# EAGLE design 8bitPig-BaconHomev2-mainPCB (EAGLE 9.2.2)
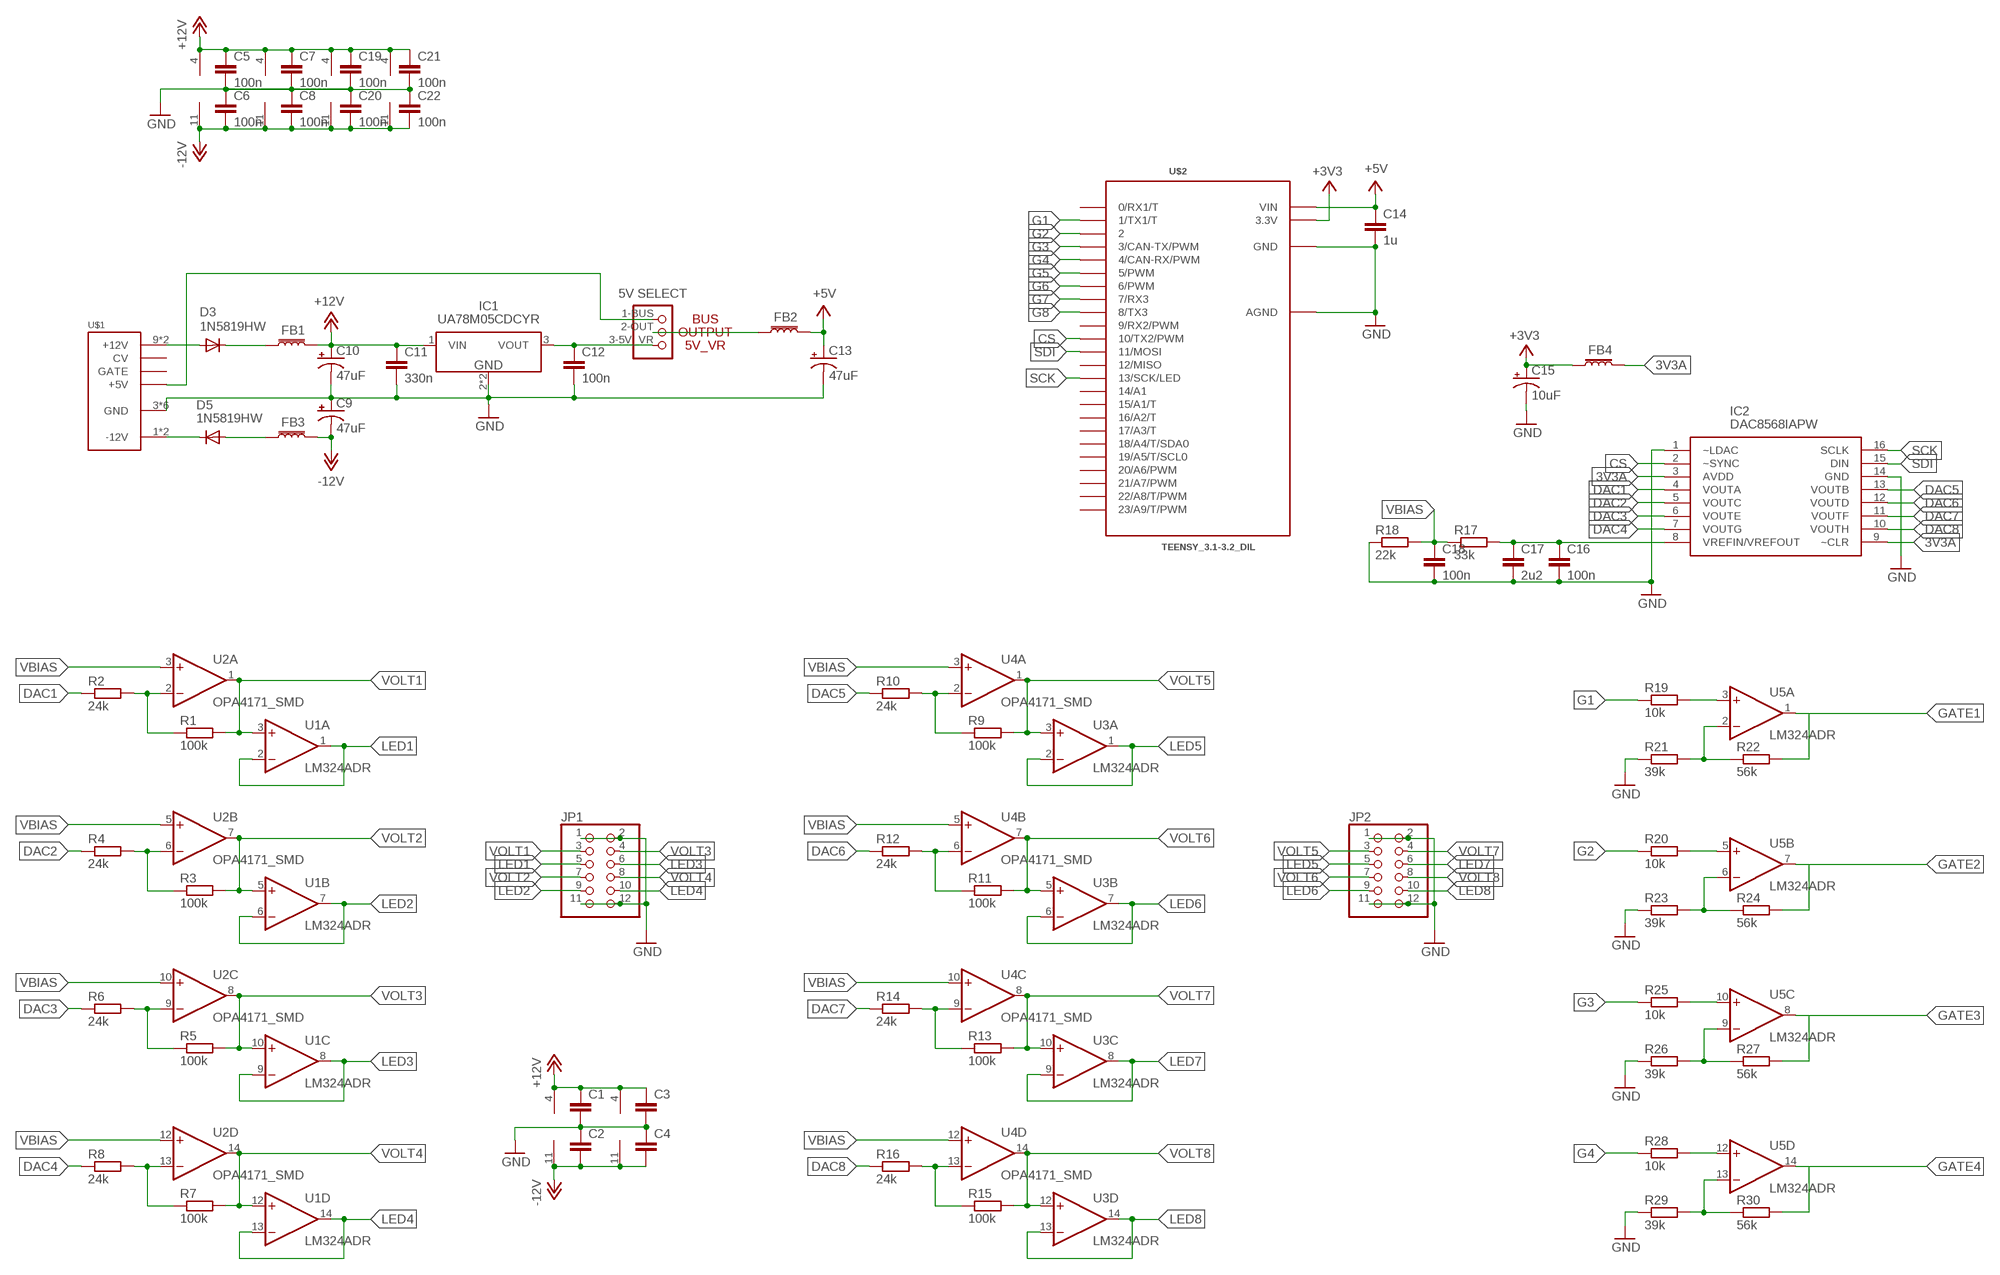
[diagram p0: schematic, sheet 1, part 1 of 2]
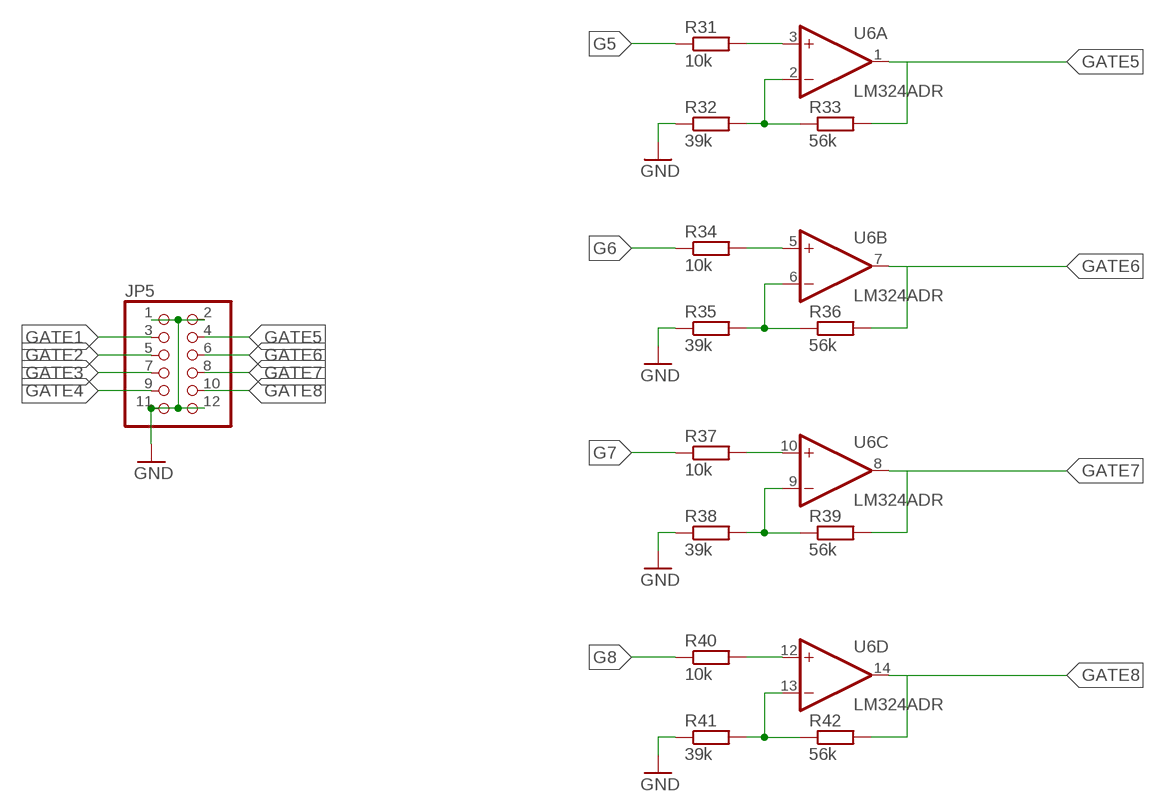
[diagram p1: schematic, sheet 1, part 2 of 2]

## Parts
C1  C-EUC0603  [C0603]
C2  C-EUC0603  [C0603]
C3  C-EUC0603  [C0603]
C4  C-EUC0603  [C0603]
C5  100n  C-EUC0603  [C0603]
C6  100n  C-EUC0603  [C0603]
C7  100n  C-EUC0603  [C0603]
C8  100n  C-EUC0603  [C0603]
C9  47uF  47UF-POLAR-PANASONIC_D-35V-20%  [PANASONIC_D]
C10  47uF  47UF-POLAR-PANASONIC_D-35V-20%  [PANASONIC_D]
C11  330n  C-EUC0603  [C0603]
C12  100n  C-EUC0603  [C0603]
C13  47uF  47UF-POLAR-PANASONIC_D-35V-20%  [PANASONIC_D]
C14  1u  C-EUC0603  [C0603]
C15  10uF  47UF-POLAR-PANASONIC_D-35V-20%  [PANASONIC_D]
C16  100n  C-EUC0603  [C0603]
C17  2u2  C-EUC0603  [C0603]
C18  100n  C-EUC0603  [C0603]
C19  100n  C-EUC0603  [C0603]
C20  100n  C-EUC0603  [C0603]
C21  100n  C-EUC0603  [C0603]
C22  100n  C-EUC0603  [C0603]
D3  1N5819HW  DIODE_DIODE-SOD123  [DIODE_SOD123]
D5  1N5819HW  DIODE_DIODE-SOD123  [DIODE_SOD123]
FB1  30Ω/1.8A  FERRITE_BEAD-0603  [0603]
FB2  30Ω/1.8A  FERRITE_BEAD-0603  [0603]
FB3  30Ω/1.8A  FERRITE_BEAD-0603  [0603]
FB4  30Ω/1.8A  FERRITE_BEAD-0603  [0603]
IC1  UA78M05CDCYR  [SOT230P700X180-4N]
IC2  DAC8568IAPW  [SOP65P640X120-16N]
JP1  PINHD-2X6  [2X06]
JP2  PINHD-2X6  [2X06]
JP5  PINHD-2X6  [2X06]
JP_5V  SELECTOR_POWER  [SELECTOR_POWER]
R1  100k  R-EU_R0603  [R0603]
R2  24k  R-EU_R0603  [R0603]
R3  100k  R-EU_R0603  [R0603]
R4  24k  R-EU_R0603  [R0603]
R5  100k  R-EU_R0603  [R0603]
R6  24k  R-EU_R0603  [R0603]
R7  100k  R-EU_R0603  [R0603]
R8  24k  R-EU_R0603  [R0603]
R9  100k  R-EU_R0603  [R0603]
R10  24k  R-EU_R0603  [R0603]
R11  100k  R-EU_R0603  [R0603]
R12  24k  R-EU_R0603  [R0603]
R13  100k  R-EU_R0603  [R0603]
R14  24k  R-EU_R0603  [R0603]
R15  100k  R-EU_R0603  [R0603]
R16  24k  R-EU_R0603  [R0603]
R17  33k  R-EU_R0603  [R0603]
R18  22k  R-EU_R0603  [R0603]
R19  10k  R-EU_R0603  [R0603]
R20  10k  R-EU_R0603  [R0603]
R21  39k  R-EU_R0603  [R0603]
R22  56k  R-EU_R0603  [R0603]
R23  39k  R-EU_R0603  [R0603]
R24  56k  R-EU_R0603  [R0603]
R25  10k  R-EU_R0603  [R0603]
R26  39k  R-EU_R0603  [R0603]
R27  56k  R-EU_R0603  [R0603]
R28  10k  R-EU_R0603  [R0603]
R29  39k  R-EU_R0603  [R0603]
R30  56k  R-EU_R0603  [R0603]
R31  10k  R-EU_R0603  [R0603]
R32  39k  R-EU_R0603  [R0603]
R33  56k  R-EU_R0603  [R0603]
R34  10k  R-EU_R0603  [R0603]
R35  39k  R-EU_R0603  [R0603]
R36  56k  R-EU_R0603  [R0603]
R37  10k  R-EU_R0603  [R0603]
R38  39k  R-EU_R0603  [R0603]
R39  56k  R-EU_R0603  [R0603]
R40  10k  R-EU_R0603  [R0603]
R41  39k  R-EU_R0603  [R0603]
R42  56k  R-EU_R0603  [R0603]
U1  LM324ADR  TL074_SMD  [SO14]
U2  OPA4171_SMD  [SO14]
U3  LM324ADR  TL074_SMD  [SO14]
U4  OPA4171_SMD  [SO14]
U5  LM324ADR  TL074_SMD  [SO14]
U6  LM324ADR  TL074_SMD  [SO14]
U$1  POWER  [POWER_16]
U$2  TEENSY_3.1-3.2_DIL  [TEENSY_3.0-3.2&LC_DIL]

## Nets
3V3A: FB4.2 IC2.3(AVDD) IC2.9(~CLR)
+3V3: C15.+ FB4.1 U$2.3.3V
+5V [pwr]: C13.+ C14.1 FB2.2 U$2.VIN
+12V [pwr]: C1.1 C3.1 C5.1 C7.1 C10.+ C11.1 C19.1 C21.1 FB1.2 IC1.1(VIN) U1.4(P:V+) U2.4(P:V+) U3.4(P:V+) U4.4(P:V+) U5.4(P:V+) U6.4(P:V+)
-12V [pwr]: C2.2 C4.2 C6.2 C8.2 C9.- C20.2 C22.2 FB3.2 U1.11(P:V-) U2.11(P:V-) U3.11(P:V-) U4.11(P:V-) U5.11(P:V-) U6.11(P:V-)
CS [spi]: IC2.2(~SYNC) U$2.10(10/TX2/PWM)
DAC1: IC2.4(VOUTA) R2.1
DAC2: IC2.5(VOUTC) R4.1
DAC3: IC2.6(VOUTE) R6.1
DAC4: IC2.7(VOUTG) R8.1
DAC5: IC2.13(VOUTB) R10.1
DAC6: IC2.12(VOUTD) R12.1
DAC7: IC2.11(VOUTF) R14.1
DAC8: IC2.10(VOUTH) R16.1
G1: R19.1 U$2.1(1/TX1/T)
G2: R20.1 U$2.2
G3: R25.1 U$2.3(3/CAN-TX/PWM)
G4: R28.1 U$2.4(4/CAN-RX/PWM)
G5: R31.1 U$2.5(5/PWM)
G6: R34.1 U$2.6(6/PWM)
G7: R37.1 U$2.7(7/RX3)
G8: R40.1 U$2.8(8/TX3)
GATE1: JP5.3 R22.2 U5.1(A:OUT)
GATE2: JP5.5 R24.2 U5.7(B:OUT)
GATE3: JP5.7 R27.2 U5.8(C:OUT)
GATE4: JP5.9 R30.2 U5.14(D:OUT)
GATE5: JP5.4 R33.2 U6.1(A:OUT)
GATE6: JP5.6 R36.2 U6.7(B:OUT)
GATE7: JP5.8 R39.2 U6.8(C:OUT)
GATE8: JP5.10 R42.2 U6.14(D:OUT)
GND [pwr]: C1.2 C2.1 C3.2 C4.1 C5.2 C6.1 C7.2 C8.1 C9.+ C10.- C11.2 C12.2 C13.- C14.2 C15.- C16.2 C17.2 C18.2 C19.2 C20.1 C21.2 C22.1 IC1.2(GND) IC1.4(GND) IC2.1(~LDAC) IC2.14(GND) JP1.1 JP1.2 JP1.11 JP1.12 JP2.1 JP2.2 JP2.11 JP2.12 JP5.1 JP5.2 JP5.11 JP5.12 R18.1 R21.1 R23.1 R26.1 R29.1 R32.1 R35.1 R38.1 R41.1 U$1.3(GND) U$1.4(GND) U$1.5(GND) U$1.6(GND) U$1.7(GND) U$1.8(GND) U$2.AGND U$2.GND
LED1: JP1.5 U1.1(A:OUT) U1.2(A:-IN)
LED2: JP1.9 U1.6(B:-IN) U1.7(B:OUT)
LED3: JP1.6 U1.8(C:OUT) U1.9(C:-IN)
LED4: JP1.10 U1.13(D:-IN) U1.14(D:OUT)
LED5: JP2.5 U3.1(A:OUT) U3.2(A:-IN)
LED6: JP2.9 U3.6(B:-IN) U3.7(B:OUT)
LED7: JP2.6 U3.8(C:OUT) U3.9(C:-IN)
LED8: JP2.10 U3.13(D:-IN) U3.14(D:OUT)
N$1: R1.1 R2.2 U2.2(A:-IN)
N$2: R3.1 R4.2 U2.6(B:-IN)
N$3: R5.1 R6.2 U2.9(C:-IN)
N$4: R7.1 R8.2 U2.13(D:-IN)
N$5: R9.1 R10.2 U4.2(A:-IN)
N$6: R11.1 R12.2 U4.6(B:-IN)
N$7: R13.1 R14.2 U4.9(C:-IN)
N$8: R15.1 R16.2 U4.13(D:-IN)
N$9: D3.A U$1.9(+12V) U$1.10(+12V)
N$10: D5.C U$1.1(-12V) U$1.2(-12V)
N$11: D5.A FB3.1
N$12: D3.C FB1.1
N$13: JP_5V.1-BUS U$1.11(+5V) U$1.12(+5V)
N$14: C12.1 IC1.3(VOUT) JP_5V.3-5V_VR(3-VR)
N$15: FB2.1 JP_5V.2-OUT
N$16: C16.1 C17.1 IC2.8(VREFIN/VREFOUT) R17.2
N$17: R19.2 U5.3(A:+IN)
N$18: R20.2 U5.5(B:+IN)
N$19: R21.2 R22.1 U5.2(A:-IN)
N$20: R23.2 R24.1 U5.6(B:-IN)
N$21: R25.2 U5.10(C:+IN)
N$22: R26.2 R27.1 U5.9(C:-IN)
N$23: R28.2 U5.12(D:+IN)
N$24: R29.2 R30.1 U5.13(D:-IN)
N$25: R31.2 U6.3(A:+IN)
N$26: R32.2 R33.1 U6.2(A:-IN)
N$27: R34.2 U6.5(B:+IN)
N$28: R35.2 R36.1 U6.6(B:-IN)
N$29: R37.2 U6.10(C:+IN)
N$30: R38.2 R39.1 U6.9(C:-IN)
N$31: R40.2 U6.12(D:+IN)
N$32: R41.2 R42.1 U6.13(D:-IN)
SCK [spi]: IC2.16(SCLK) U$2.13(13/SCK/LED)
SDI [spi]: IC2.15(DIN) U$2.11(11/MOSI)
VBIAS [pwr]: C18.1 R17.1 R18.2 U2.3(A:+IN) U2.5(B:+IN) U2.10(C:+IN) U2.12(D:+IN) U4.3(A:+IN) U4.5(B:+IN) U4.10(C:+IN) U4.12(D:+IN)
VOLT1: JP1.3 R1.2 U1.3(A:+IN) U2.1(A:OUT)
VOLT2: JP1.7 R3.2 U1.5(B:+IN) U2.7(B:OUT)
VOLT3: JP1.4 R5.2 U1.10(C:+IN) U2.8(C:OUT)
VOLT4: JP1.8 R7.2 U1.12(D:+IN) U2.14(D:OUT)
VOLT5: JP2.3 R9.2 U3.3(A:+IN) U4.1(A:OUT)
VOLT6: JP2.7 R11.2 U3.5(B:+IN) U4.7(B:OUT)
VOLT7: JP2.4 R13.2 U3.10(C:+IN) U4.8(C:OUT)
VOLT8: JP2.8 R15.2 U3.12(D:+IN) U4.14(D:OUT)
Unconnected: U$1.13(CV) U$1.14(CV) U$1.15(GATE) U$1.16(GATE) U$2.0(0/RX1/T) U$2.9(9/RX2/PWM) U$2.12(12/MISO) U$2.14/A0(14/A1) U$2.15/A1(15/A1/T) U$2.16/A2(16/A2/T) U$2.17/A3(17/A3/T) U$2.18/A4(18/A4/T/SDA0) U$2.19/A5(19/A5/T/SCL0) U$2.20/A6(20/A6/PWM) U$2.21/A7(21/A7/PWM) U$2.22/A8(22/A8/T/PWM) U$2.23/A9(23/A9/T/PWM)

## Library data of the parts
C1-C8 C11 C12 C14 C16-C22 = resistor:C-EU: CAPACITOR, European symbol
C9 C10 C13 = SparkFun-Capacitors:47UF-POLAR: 47µF polarized capacitors A capacitor is a passive two-terminal electrical component used to store electrical energy temporarily in an electric field.; PROD_ID: CAP-08478
C15 = SparkFun-Capacitors:47UF-POLAR: 47µF polarized capacitors A capacitor is a passive two-terminal electrical component used to store electrical energy temporarily in an electric field.; PROD_ID: CAP-08478; VALUE: 47uF
D3 D5 = grids_v02:DIODE_DIODE-: DIODE
FB1-FB4 = SparkFun-Coils:FERRITE_BEAD: Ferrite Bead (blocks, cores, rings, chokes, etc.) Inductor with layers of ferrite used to suppress high frequencies. Often used to isolate high frequency noise. SparkFun Products: IOIO-OTG - V2.2 <https://www.sparkfun.com/products/13613> SparkFun SAMD21 Mini Breakout <https://www.sparkfun.com/products/13664> SparkFun 6 Degrees of Freedom Breakout - LSM6DS3 <https://www.sparkfun.com/products/13339> SparkFun SAMD21 Dev Breakout <https://www.sparkfun.com/products/13672>; PROD_ID: NDUC-07859
IC1 = SamacSys_Parts:UA78M05CDCYR: 500-mA, 25-V, Linear Voltage Regulators Source: Datasheet <http://www.ti.com/lit/gpn/ua78m>; DESCRIPTION: 500-mA, 25-V, Linear Voltage Regulators; HEIGHT: 1.8mm; MANUFACTURER_NAME: Texas Instruments; MANUFACTURER_PART_NUMBER: UA78M05CDCYR; MOUSER_PART_NUMBER: 595-UA78M05CDCYR; MOUSER_PRICE-STOCK: https://www.mouser.com/Search/Refine.aspx?Keyword=595-UA78M05CDCYR
IC2 = SamacSys_Parts:DAC8568IAPW: 16-bit, octal-channel, ultra-low glitch, voltage output DAC with 2.5V, 2ppm/C internal reference Source: Datasheet <http://www.ti.com/lit/gpn/dac8568>; DESCRIPTION: 16-bit, octal-channel, ultra-low glitch, voltage output DAC with 2.5V, 2ppm/C internal reference; HEIGHT: mm; MANUFACTURER_NAME: Texas Instruments; MANUFACTURER_PART_NUMBER: DAC8568IAPW; MOUSER_PART_NUMBER: 595-DAC8568IAPW; MOUSER_PRICE-STOCK: https://www.mouser.com/Search/Refine.aspx?Keyword=595-DAC8568IAPW
JP1 JP2 JP5 = pinhead:PINHD-2X6: PIN HEADER
JP_5V = SchnitzelsComponents:SELECTOR_POWER: PIN HEADER
R1-R42 = resistor:R-EU_: RESISTOR, European symbol
U1 U3 U5 U6 = SchnitzelsComponents:TL074: Generic Quad Op Amp
U2 U4 = SchnitzelsComponents:OPA4171: Generic Quad Op Amp
U$1 = eurorack:POWER
U$2 = Teensy_3_and_LC_Series_Boards_v1.4:TEENSY_3.1-3.2_DIL: Teensy 3.1 or 3.2 in a DIL Layout.

## Net classes
0 default: width 0.152 mm, clearance 0.254 mm
1 pwr: width 0.254 mm, clearance 0.254 mm
2 spi: width 0.152 mm, clearance 0.254 mm

## Board
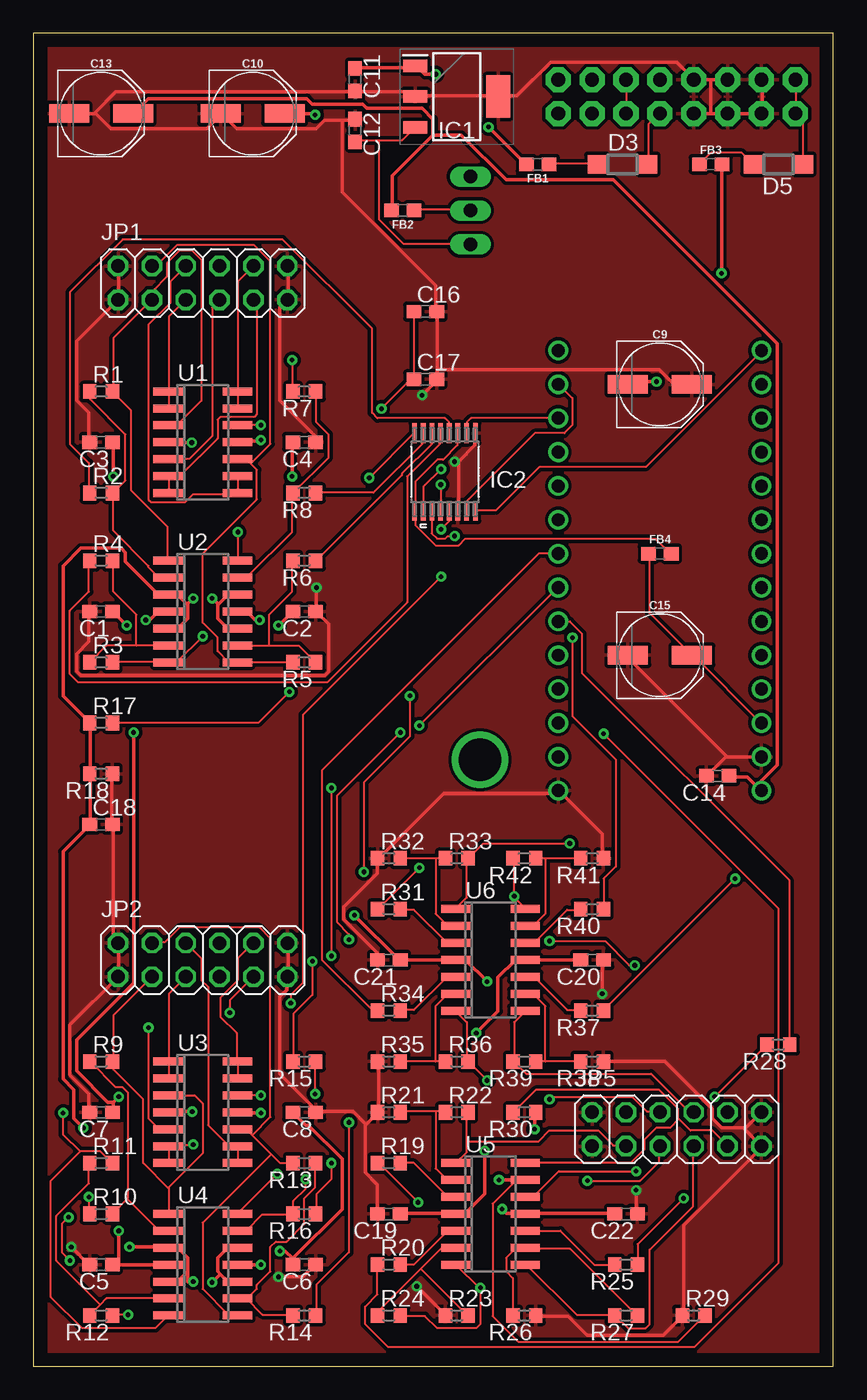
[diagram p2: board, top side]
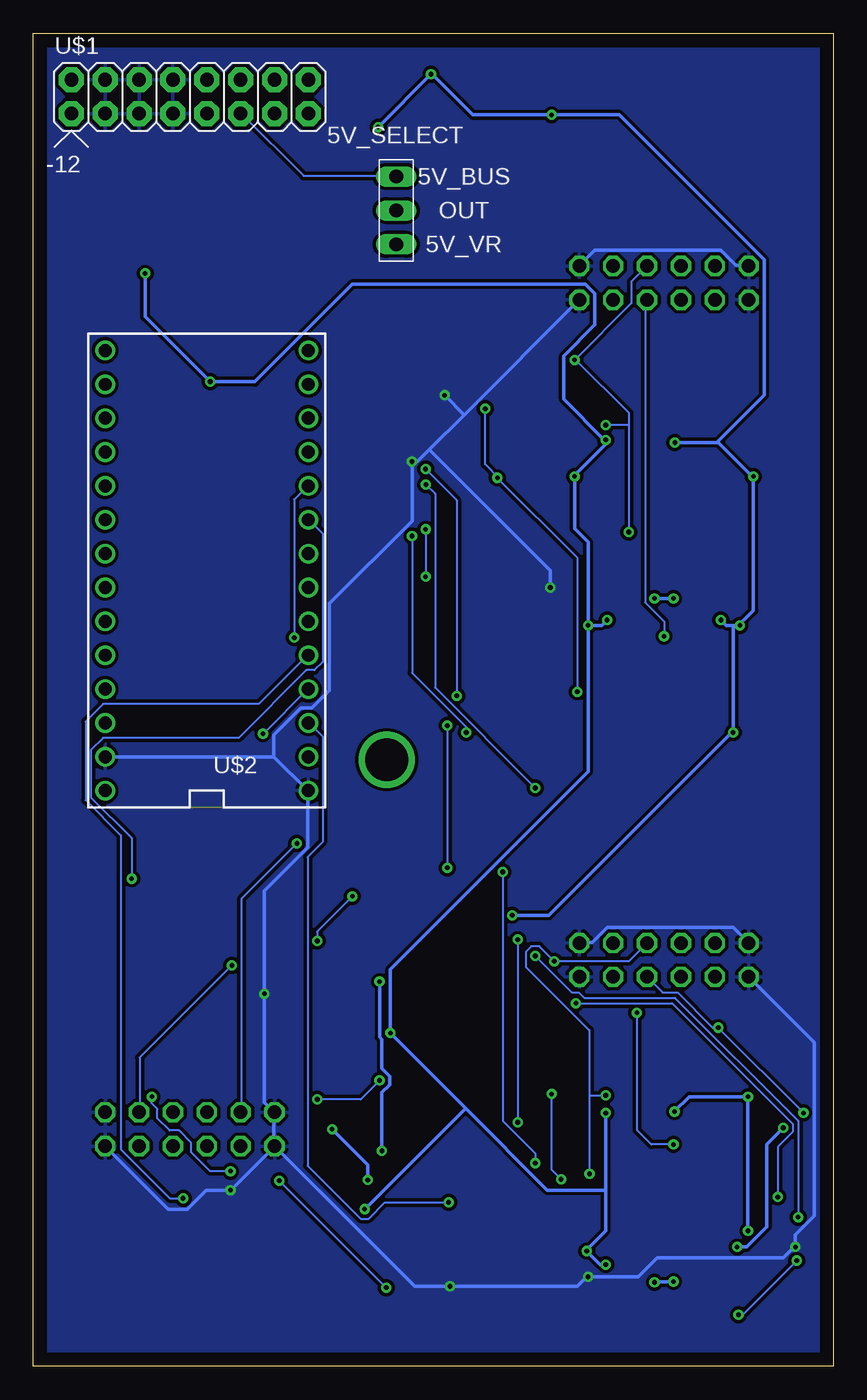
[diagram p3: board, bottom side, seen from below]

Size 60 x 100 mm. Coordinates in mm from the lower left corner, seen from the top.
Outline: 0,0 60,0 60,100 0,100 0,0
Copper layers (1*16): Top 0.035mm / dielectric 1.5mm / Bottom 0.035mm
Design rules "default": minimum track width 6mil, minimum drill 0.35mm, track to track 6mil, track to pad 6mil, pad to pad 6mil, via to via 6mil, smd to smd 6mil, copper to edge 40mil, drill to drill 6mil, minimum pad ring 10mil, minimum via ring 8mil, stop-mask expansion 4mil, vias tented up to drill 0mil, thermal gap 10mil

### Footprints (pad centres in the part's own frame; a part is rotated, then mirrored left to right if it is on the bottom)
C0603 = smd 1.1 x 1: 1 -0.85,0; 2 0.85,0
PANASONIC_D = smd 3 x 1.4: + 2.4,0; - -2.4,0
DIODE_SOD123 = smd 1.4 x 1.4: A 1.9,0; C -1.9,0
0603 = smd 1.1 x 1: 1 -0.85,0; 2 0.85,0
SOT230P700X180-4N = smd 1.8 x 0.95: 1 -3.1,2.3; 2 -3.1,0; 3 -3.1,-2.3 | smd 1.8 x 3.2: 4 3.1,0
SOP65P640X120-16N = smd 1.473 x 0.356: 1 -2.921,2.286; 2 -2.921,1.626; 3 -2.921,0.965; 4 -2.921,0.33; 5 -2.921,-0.33; 6 -2.921,-0.965; 7 -2.921,-1.626; 8 -2.921,-2.286; 9 2.921,-2.286; 10 2.921,-1.626; 11 2.921,-0.965; 12 2.921,-0.33; 13 2.921,0.33; 14 2.921,0.965; 15 2.921,1.626; 16 2.921,2.286
2X06 = drill 1.016 octagon: 1 -6.35,-1.27; 2 -6.35,1.27; 3 -3.81,-1.27; 4 -3.81,1.27; 5 -1.27,-1.27; 6 -1.27,1.27; 7 1.27,-1.27; 8 1.27,1.27; 9 3.81,-1.27; 10 3.81,1.27; 11 6.35,-1.27; 12 6.35,1.27
SELECTOR_POWER = drill 1.016 long: 1-BUS 0,5.08; 2-OUT 0,2.54; 3-5V_VR 0,0
R0603 = smd 1 x 1.1: 1 -0.85,0; 2 0.85,0
SO14 = smd 0.6 x 2.2: 1 -3.81,-2.6; 2 -2.54,-2.6; 3 -1.27,-2.6; 4 0,-2.6; 5 1.27,-2.6; 6 2.54,-2.6; 7 3.81,-2.6; 8 3.81,2.6; 9 2.54,2.6; 10 1.27,2.6; 11 0,2.6; 12 -1.27,2.6; 13 -2.54,2.6; 14 -3.81,2.6
POWER_16 = drill 1.016 pad 1.88 octagon: 1 -6.35,-1.27; 2 -6.35,1.27; 3 -3.81,-1.27; 4 -3.81,1.27; 5 -1.27,-1.27; 6 -1.27,1.27; 7 1.27,-1.27; 8 1.27,1.27; 9 3.81,-1.27; 10 3.81,1.27; 11 6.35,-1.27; 12 6.35,1.27; 13 8.89,-1.27; 14 8.89,1.27; 15 11.43,-1.27; 16 11.43,1.27
TEENSY_3.0-3.2&LC_DIL = drill 0.965: 0 -7.62,13.97; 1 -7.62,11.43; 2 -7.62,8.89; 3 -7.62,6.35; 3.3V 7.62,11.43; 4 -7.62,3.81; 5 -7.62,1.27; 6 -7.62,-1.27; 7 -7.62,-3.81; 8 -7.62,-6.35; 9 -7.62,-8.89; 10 -7.62,-11.43; 11 -7.62,-13.97; 12 -7.62,-16.51; 13 7.62,-16.51; 14/A0 7.62,-13.97; 15/A1 7.62,-11.43; 16/A2 7.62,-8.89; 17/A3 7.62,-6.35; 18/A4 7.62,-3.81; 19/A5 7.62,-1.27; 20/A6 7.62,1.27; 21/A7 7.62,3.81; 22/A8 7.62,6.35; 23/A9 7.62,8.89; AGND 7.62,13.97; GND -7.62,16.51; VIN 7.62,16.51

### Placement (x,y rotation side)
C1  5.08,56.62 180 top
C2  20.32,56.62 180 top
C3  5.08,69.32 180 top
C4  20.32,69.32 180 top
C5  5.08,7.62 180 top
C6  20.32,7.62 180 top
C7  5.08,19.05 180 top
C8  20.32,19.05 180 top
C9  46.99,73.66 0 top
C10  16.45,93.98 0 top
C11  24.13,96.52 270 top
C12  24.13,92.71 90 top
C13  5.08,93.98 0 top
C14  51.33,44.29 180 top
C15  46.99,53.34 0 top
C16  29.4,79.12 0 top
C17  29.4,74.04 0 top
C18  5.08,40.64 0 top
C19  26.67,11.43 180 top
C20  41.91,30.48 180 top
C21  26.67,30.48 180 top
C22  44.45,11.43 180 top
D3  44.18,90.17 0 top
D5  55.88,90.17 180 top
FB1  37.83,90.17 180 top
FB2  27.7,86.71 180 top
FB3  50.8,90.17 0 top
FB4  46.99,60.96 0 top
IC1  31.75,95.25 0 top
IC2  30.87,67.09 270 top
JP1  12.7,81.28 0 top
JP2  12.7,30.48 0 top
JP5  48.26,17.78 0 top
JP_5V  32.78,84.17 0 bottom
R1  5.08,73.13 0 top
R2  5.08,65.51 0 top
R3  5.08,52.81 0 top
R4  5.08,60.43 0 top
R5  20.32,52.81 180 top
R6  20.32,60.43 180 top
R7  20.32,73.13 180 top
R8  20.32,65.51 180 top
R9  5.08,22.86 0 top
R10  5.08,11.43 0 top
R11  5.08,15.24 0 top
R12  5.08,3.81 180 top
R13  20.32,15.24 180 top
R14  20.32,3.81 180 top
R15  20.32,22.86 180 top
R16  20.32,11.43 180 top
R17  5.08,48.26 0 top
R18  5.08,44.45 180 top
R19  26.67,15.24 0 top
R20  26.67,7.62 0 top
R21  26.67,19.05 0 top
R22  31.75,19.05 0 top
R23  31.75,3.81 0 top
R24  26.67,3.81 0 top
R25  44.45,7.62 180 top
R26  36.83,3.81 180 top
R27  44.45,3.81 180 top
R28  55.88,24.13 180 top
R29  49.53,3.81 0 top
R30  36.83,19.05 180 top
R31  26.67,34.29 0 top
R32  26.67,38.1 0 top
R33  31.75,38.1 0 top
R34  26.67,26.67 0 top
R35  26.67,22.86 0 top
R36  31.75,22.86 0 top
R37  41.91,26.67 180 top
R38  41.91,22.86 180 top
R39  36.83,22.86 180 top
R40  41.91,34.29 180 top
R41  41.91,38.1 180 top
R42  36.83,38.1 180 top
U1  12.7,69.32 270 top
U2  12.7,56.62 270 top
U3  12.7,19.05 270 top
U4  12.7,7.62 270 top
U5  34.29,11.43 270 top
U6  34.29,30.48 270 top
U$1  50.8,95.25 0 bottom
U$2  46.99,59.69 180 bottom

### Tracks (layer width: path | path; a pad name or v marks a point on that pad's centre or on a via)
3V3A
  Top 0.152: FB4.2 47.75,60.96 46.63,62.08 32.41,62.08 31.9,61.57 30.18,61.57 28.65,63.09 28.65,64.11 IC2.9 28.65,64.21 28.65,66.38 30.29,68.02 30.73,68.02 31.8,69.09 31.8,70 IC2.3
+3V3
  Top 0.152: FB4.1 46.23,60.96 46.23,56.49 49.38,53.34 C15.+ 49.48,53.34 54.56,48.26 U$2.3.3V
+5V
  Top 0.254: C14.1 52.22,44.2 53.54,44.2 54.56,43.18 U$2.VIN 54.25,43.59 55.78,45.11 55.78,76.71 43.48,89 35.46,89 32.11,92.35 29.97,92.35 | 29.97,92.35 26.92,89.31 26.92,86.77 FB2.2 | 29.97,92.35 29.97,93.57 29.16,94.39 24.99,94.39 24.69,94.69 20.93,94.69 20.52,95.1 8.64,95.1 7.52,93.98 C13.+
+12V  (via drill 0.35)
  Top 0.254: C11.1 24.18,97.43 28.45,97.43 28.55,97.54 IC1.1 28.75,97.54 29.36,96.93 v30.18,96.93 | v34.14,92.96 36.88,90.22 FB1.2 | C10.+ 21.03,93.98 v21.13,93.88 | C19.1 27.53,11.48 31.6,11.48 U5.4 31.8,11.48 32.41,11.48 33.86,12.93 v33.86,16.15 | v34.04,28.85 32.41,30.48 U6.4 C21.1 27.43,30.48 v24.08,33.83 | U4.4 C5.1 6.4,7.72 v6.4,10.16 | 5.99,19.81 5.99,19.1 C7.1 | v6.4,20.22 5.99,19.81 | v11.91,19.1 10.16,19.1 U3.4 | v7.01,55.58 5.99,56.59 C1.1 | v8.43,55.98 8.74,55.98 9.35,56.59 10.06,56.59 U2.4 | v5.99,66.75 5.99,69.29 C3.1 | v11.89,69.29 10.16,69.29 U1.4 | 5.99,19.81 5.59,19.81 3.25,22.15 3.25,24.49 7.52,28.75 v7.52,47.55
  Bottom 0.254: v34.14,92.96 v30.18,96.93 30.07,96.93 27.03,93.88 v21.13,93.88 16.05,93.88 5.18,83.01 5.18,72.85 8.64,69.39 8.64,69.29 | v34.04,28.85 34.04,24.69 33.88,24.54 33.86,24.51 33.86,22.33 33.28,21.75 33.28,21.12 33.86,20.54 v33.86,16.15 | v11.91,19.1 10.79,20.22 v6.4,20.22 v6.4,10.16 | 7.52,55.58 8.03,55.58 v8.43,55.98 | 7.52,55.58 v7.01,55.58 7.01,55.68 5.99,56.69 v5.99,66.75 6.1,66.75 8.64,69.29 | 8.64,69.29 v11.89,69.29 | 7.52,55.58 v7.52,47.55 7.62,47.55 21.34,33.83 v24.08,33.83
-12V  (via drill 0.35)
  Top 0.254: v51.61,81.99 51.61,90.12 FB3.2 | v46.74,73.86 44.81,73.86 44.6,73.66 C9.- | v18.39,55.58 19.41,56.59 C2.2 | v16.97,55.98 16.66,55.98 16.05,56.59 15.34,56.59 U2.11 | v19.41,66.75 19.41,69.29 C4.2 | v17.07,69.49 16.97,69.39 15.34,69.39 U1.11 | C22.2 43.59,11.48 36.98,11.48 U5.11 36.78,11.48 35.46,11.48 v35.15,11.79 | C20.2 U6.11 36.17,30.48 34.85,29.16 34.85,26.62 v33.22,24.99 | 19.51,8.13 19.51,7.62 C6.2 | 19.51,8.13 23.16,11.79 23.16,15.54 20.62,18.09 20.42,18.09 19.51,19 C8.2 | v17.07,7.62 U4.11 | v18.49,8.64 18.9,8.64 19.41,8.13 19.51,8.13 | v17.07,19 15.34,19 U3.11
  Bottom 0.254: v51.61,81.99 51.61,78.74 v46.74,73.86 43.38,73.86 36.07,81.18 18.59,81.18 17.88,80.47 17.88,78.13 20.22,75.79 20.22,72.54 17.17,69.49 v17.07,69.49 17.07,69.19 19.41,66.85 v19.41,66.75 19.41,62.84 18.39,61.82 v18.39,55.58 | v18.39,55.58 17.37,55.58 v16.97,55.98 | v17.07,7.62 17.48,7.62 v18.49,8.64 18.49,8.74 17.07,10.16 17.07,13.21 | 17.07,13.21 v17.07,19 | 27.58,19.36 21.44,13.21 17.07,13.21 | 27.58,19.36 v33.22,24.99 33.22,29.77 18.39,44.6 v18.39,55.58 | 27.58,19.36 v35.15,11.79
CS
  Top 0.152: U$2.10 32.82,71.12 32.51,70.81 32.51,70.1 IC2.2
DAC1
  Top 0.152: R2.1 4.17,65.53 4.17,67.77 2.74,69.19 2.74,80.57 6.71,84.53 18.69,84.53 25.4,77.83 25.4,71.53 25.81,71.12 30.89,71.12 31.19,70.81 31.19,70.1 IC2.4
DAC2
  Top 0.152: R4.1 4.17,60.35 4.17,58.12 2.74,56.69 2.74,51.92 3.35,51.31 22.05,51.31 28.04,57.3 28.04,66.75 30.48,69.19 30.48,70 IC2.5
DAC3
  Top 0.152: R6.1 21.23,60.45 27.64,66.85 27.64,66.95 29.87,69.19 29.87,70 IC2.6
DAC4
  Top 0.152: R8.1 21.23,65.53 25.5,65.53 29.16,69.19 29.16,70 IC2.7
DAC5  (via drill 0.35)
  Top 0.152: v4.17,12.7 4.17,11.48 R10.1 | v19.3,27.23 19.3,27.84 20.22,28.75 20.22,48.87 v30.58,59.23 | v30.58,62.79 31.19,63.4 31.19,64.11 IC2.13
  Bottom 0.152: v4.17,12.7 4.17,16.46 3.05,17.58 3.05,18.19 12.09,27.23 v19.3,27.23 | v30.58,62.79 v30.58,59.23
DAC6  (via drill 0.35)
  Top 0.152: v7.11,3.86 5.99,3.86 R12.1 | v2.74,7.92 2.13,8.53 2.13,10.67 v2.64,11.18 | v22.35,43.38 v22.35,30.79 | v30.56,66.14 30.56,64.24 30.58,64.21 IC2.12
  Bottom 0.152: v7.11,3.86 6.81,3.86 v2.74,7.92 | v2.64,11.18 2.64,18.39 11.89,27.64 18.69,27.64 19.1,28.04 19.61,28.04 v22.35,30.79 | v22.35,43.38 29.87,50.9 29.87,65.46 v30.56,66.14
DAC7  (via drill 0.35)
  Top 0.152: v23.67,18.29 23.67,8.53 21.23,6.1 21.23,3.86 R14.1 | v23.67,32 23.67,32.41 22.76,33.33 22.76,42.77 v27.53,47.55 | v31.6,62.28 31.09,62.28 30.89,62.08 30.28,62.08 29.87,62.48 29.87,64.11 IC2.11
  Bottom 0.152: v23.67,32 v23.67,18.29 | v27.53,47.55 27.53,47.95 31.6,52.02 v31.6,62.28
DAC8  (via drill 0.35)
  Top 0.152: v22.35,15.24 22.35,14.02 21.23,12.9 21.23,11.48 R16.1 | v24.79,37.08 24.79,43.79 28.25,47.24 v28.25,50.29 | IC2.10 29.26,64.21 29.26,64.77 29.26,64.92 29.26,65.99 v30.58,67.31
  Bottom 0.152: v22.35,15.24 22.35,15.95 24.79,18.39 v24.79,37.08 | v28.25,50.29 28.25,64.97 v30.58,67.31
G1  (via drill 0.35)
  Top 0.152: v28.85,12.29 25.91,15.24 R19.1
  Bottom 0.152: v28.85,12.29 33.63,12.29 34.85,11.07 35.46,11.07 39.42,15.04 39.42,38.2 38.3,39.32 38.3,47.24 39.32,48.26 U$2.1
G2  (via drill 0.35)
  Top 0.152: v42.77,47.45 55.88,34.34 55.88,7.72 49.58,1.42 26.62,1.42 24.89,3.15 24.89,4.47 25.81,5.38 25.81,7.62 R20.1
  Bottom 0.152: v42.77,47.45 39.42,50.8 U$2.2
G3  (via drill 0.35)
  Top 0.152: v48.77,12.6 45.31,9.14 45.31,7.62 R25.1
  Bottom 0.152: v48.77,12.6 49.78,12.6 53.44,16.26 53.44,39.83 56.08,42.47 56.08,48.36 54.76,49.68 43.08,49.68 39.42,53.34 U$2.3
G4
  Top 0.152: U$2.4 40.23,55.88 41.15,54.97 41.15,52.02 56.69,36.47 56.69,24.18 R28.1
G5  (via drill 0.35)
  Top 0.152: v28.96,37.39 25.91,34.34 R31.1 | v28.96,48.06 39.32,58.42 U$2.5
  Bottom 0.152: v28.96,48.06 v28.96,37.39
G6
  Top 0.152: U$2.6 37.9,60.96 21.64,44.7 21.64,30.48 25.4,26.72 25.81,26.72 R34.1
G7  (via drill 0.35)
  Top 0.152: v52.63,36.58 42.77,26.72 R37.1
  Bottom 0.152: v52.63,36.58 52.63,39.62 55.68,42.67 55.68,46.23 54.76,47.14 44.6,47.14 39.52,52.22 38.91,52.22 38.3,52.83 38.3,62.48 39.32,63.5 U$2.7
G8  (via drill 0.35)
  Top 0.152: v40.44,54.66 40.44,48.77 43.69,45.52 43.69,37.49 42.77,36.58 42.77,34.34 R40.1
  Bottom 0.152: v40.44,54.66 40.44,65.02 39.42,66.04 U$2.8
GATE1
  Top 0.152: 32.51,16.87 32.51,16.05 U5.1 | 32.51,16.87 32.51,19 R22.2 | 32.51,16.87 37.9,16.87 38.71,17.68 42.37,17.68 43.48,16.56 44.4,16.56 JP5.3
GATE2  (via drill 0.35)
  Top 0.152: 33.48,5.84 U5.7 | 33.48,5.84 33.53,5.79 33.53,3.15 33.22,2.85 30.28,2.85 29.36,3.76 27.53,3.76 R24.2 | v41.55,13.92 45.52,13.92 46.94,15.34 46.94,16.46 JP5.5 | v33.53,5.89 33.48,5.84
  Bottom 0.152: v33.53,5.89 v41.55,13.92
GATE3
  Top 0.152: U5.8 36.98,7.62 40.74,3.86 43.59,3.86 R27.2 43.69,3.76 44.6,2.85 45.92,2.85 46.23,3.15 46.23,8.74 49.48,11.99 49.48,16.46 JP5.7
GATE4
  Top 0.152: 48.41,18.54 49.28,17.68 50.9,17.68 JP5.9 | 48.41,18.54 48.36,18.59 48.36,19.3 46.94,20.73 37.69,20.73 36.07,19.1 R30.2 | U5.14 44.81,15.24 45.82,16.26 45.82,16.97 46.74,17.88 47.75,17.88 48.41,18.54
GATE5  (via drill 0.35)
  Top 0.152: U6.1 31.7,34.34 32.51,35.15 32.51,38.1 R33.2 32.61,38.1 33.73,39.22 v40.23,39.22
  Bottom 0.152: v40.23,39.22 44.4,35.05 44.4,19.1 JP5.4
GATE6  (via drill 0.35)
  Top 0.152: U6.7 31.7,26.62 32.51,25.81 32.51,22.86 R36.2 32.61,22.86 v34.04,21.44 | v38.71,20.02 38.91,20.22 44.91,20.22 46.02,19.1 46.94,19.1 JP5.6
  Bottom 0.152: v38.71,20.02 35.46,20.02 v34.04,21.44
GATE7
  Top 0.152: 36.07,22.86 36.07,25.81 36.88,26.62 U6.8 | 36.07,22.86 36.98,21.95 46.33,21.95 49.17,19.1 49.48,19.1 JP5.8 | 36.07,22.86 R39.2
GATE8  (via drill 0.35)
  Top 0.152: R42.2 36.07,38.1 v36.07,35.26 36.07,35.15 36.88,34.34 U6.14 | v45.11,30.07 44.7,30.07 42.88,31.9 v38.71,31.9
  Bottom 0.152: v45.11,30.07 52.02,23.16 52.02,19.1 JP5.10 | v38.71,31.9 38.71,32.61 v36.07,35.26
GND  (via drill 0.35)
  Top 0.254: C1.2 4.17,56.59 4.17,54.36 3.25,53.44 3.25,52.12 3.56,51.82 21.84,51.82 22.15,52.12 22.15,55.68 21.23,56.59 C2.1 21.23,56.69 v21.23,58.42 | C3.2 4.17,69.39 4.17,71.53 3.25,72.44 3.25,76.91 JP1.1 6.4,80.06 6.4,82.5 JP1.2 | 31.9,67.87 31.9,64.21 IC2.14 | 31.9,67.87 33.12,69.09 33.12,70 IC2.1 | C4.1 21.13,69.39 21.13,69.8 18.49,72.44 18.49,79.45 JP1.11 19.1,80.06 19.1,82.5 JP1.12 | v31.6,67.87 31.9,67.87 | U$1.6 50.8,96.52 | 50.8,96.52 U$1.8 49.48,96.62 48.26,97.84 38.81,97.84 36.27,95.3 34.95,95.3 IC1.4 34.85,95.3 28.75,95.3 IC1.2 28.55,95.3 28.25,95.61 24.18,95.61 C11.2 24.08,95.61 6.2,95.61 4.67,94.08 4.67,93.98 | 50.8,93.98 U$1.5 U$1.3 54.66,94.08 54.66,96.52 U$1.4 | 50.8,93.98 U$1.7 | 50.8,93.98 50.8,96.52 | 30.28,74.78 30.28,79.05 C16.2 30.18,79.15 30.18,81.08 23.16,88.09 23.16,93.47 | 30.28,74.78 30.28,74.07 C17.2 30.28,73.97 v29.16,72.85 | 23.16,93.47 21.84,93.47 21.23,92.86 15.24,92.86 14.12,93.98 C10.- 14.02,93.88 13.01,92.86 5.79,92.86 4.67,93.98 | 23.16,93.47 24.08,93.47 C12.2 | 4.67,93.98 C13.- | C9.+ 48.06,73.66 46.94,74.78 30.28,74.78 | JP2.12 19.1,31.7 19.1,29.26 JP2.11 19,29.16 19,28.25 18.49,27.74 18.49,21.95 21.23,19.2 C8.1 21.23,19.1 23.98,19.1 24.89,18.19 24.89,18.09 | 24.89,18.09 24.89,14.53 25.81,13.61 25.81,11.48 C19.2 | 24.89,18.09 25.81,19 R21.1 25.91,19.1 25.91,22.86 R35.1 | R18.1 5.89,44.4 5.89,40.64 C18.2 5.99,40.54 5.99,32.11 JP2.2 6.4,31.7 6.4,29.26 JP2.1 2.74,25.6 2.74,21.84 4.17,20.42 4.17,19.1 C7.2 | v2.85,8.94 4.17,7.62 C5.2 | v18.39,6.71 20.22,6.71 21.13,7.62 C6.1 | v28.75,5.99 30.89,3.86 R23.1 | v45.21,13.21 45.21,11.48 C22.1
  Top 0.254: v42.67,27.94 42.67,30.48 C20.1 | R26.1 37.69,3.76 40.13,3.76 41.55,2.34 47.24,2.34 48.67,3.76 R29.1 48.77,3.86 48.77,10.57 54.66,16.46 JP5.11 53.34,17.78 53.34,17.88 | R38.1 47.35,22.86 50.9,19.3 50.9,18.59 51.61,17.88 53.34,17.88 | 53.34,17.88 53.44,17.88 JP5.12 | 51.92,45.72 50.49,44.3 C14.2 | U$2.AGND 51.92,45.72 | C15.- 44.6,53.34 44.6,53.14 51.92,45.82 51.92,45.72 | C21.2 25.81,30.48 25.81,30.99 23.27,33.53 23.27,34.44 25.81,36.98 25.81,38.1 R32.1 25.91,38.1 30.79,42.98 39.22,42.98 39.32,43.08 U$2.GND 39.42,43.18 42.67,39.93 42.67,38.1 R41.1
  Bottom 0.254: JP1.11 27.69,71.37 | 27.69,71.37 30.3,68.76 | JP1.12 17.88,83.72 8.43,83.72 7.32,82.6 6.4,82.6 JP1.2 | 30.3,68.76 21.23,59.69 v21.23,58.42 | v29.16,72.85 27.69,71.37 | JP2.1 1.42,24.28 1.42,11.28 2.85,9.86 v2.85,8.94 2.95,8.94 3.76,8.13 13.21,8.13 14.63,6.71 v18.39,6.71 18.49,6.71 19.2,5.99 v28.75,5.99 31.39,5.99 JP5.1 | JP2.2 7.52,32.92 16.97,32.92 18.09,31.8 19,31.8 JP2.12 | JP5.1 v45.21,13.21 47.04,13.21 48.46,11.79 49.89,11.79 JP5.11 | JP5.1 41.96,16.56 41.96,19 JP5.2 42.67,19.81 v42.67,27.94 42.67,35.66 39.42,38.91 39.42,43.08 U$2.GND 39.42,43.18 41.96,45.72 | 41.96,45.72 U$2.AGND | 41.96,45.72 41.96,47.35 39.93,49.38 39.12,49.38 37.8,50.7 37.8,57.2 31.6,63.4 v31.6,67.87 31.19,67.87 30.3,68.76
  pour Top: 1,99 59,99 59,1 1,1
  pour Bottom: 1,99 59,99 59,1 1,1
LED1
  Top 0.152: U1.2 10.16,71.93 10.16,73.05 U1.1 10.16,73.15 10.16,78.74 JP1.5
LED2
  Top 0.152: U1.7 10.16,65.53 10.16,66.75 U1.6 10.16,66.85 11.07,66.85 13.82,69.6 13.82,71.02 14.02,71.22 16.56,71.22 16.76,71.42 16.76,79.76 JP1.9
LED3
  Top 0.152: U1.9 15.34,66.75 15.34,65.53 U1.8 15.24,65.43 11.99,65.43 11.38,64.82 8.84,64.82 8.64,65.02 8.64,78.13 10.26,79.76 10.26,81.38 JP1.6
LED4
  Top 0.152: U1.13 15.34,71.93 15.34,73.05 U1.14 15.34,73.15 15.34,81.38 JP1.10
LED5
  Top 0.152: 10.16,22.86 10.16,21.64 U3.2 | 10.16,22.86 10.16,27.94 JP2.5 | 10.16,22.86 U3.1
LED6  (via drill 0.35)
  Top 0.152: U3.7 10.16,15.24 10.16,16.46 U3.6 10.16,16.56 11.91,16.56 v11.99,16.64 | v14.73,26.52 14.73,27.43 JP2.9
  Bottom 0.152: v11.99,16.64 13.64,16.64 14.73,17.73 v14.73,26.52
LED7
  Top 0.152: U3.8 15.34,15.24 15.34,16.46 U3.9 15.24,16.56 14.63,16.56 13.11,18.09 13.11,28.45 12.6,28.96 12.6,30.58 JP2.6
LED8
  Top 0.152: U3.13 15.34,21.64 15.34,22.86 U3.14 15.24,22.86 15.24,24.99 14.02,26.21 14.02,27.64 15.34,28.96 15.34,30.58 JP2.10
N0$33  (via drill 3.2)
  other vias: 33.5,45.5
N$1
  Top 0.152: U2.2 10.06,59.23 9.35,59.23 8.64,59.94 8.64,60.05 5.99,62.69 5.99,65.43 R2.2 5.99,65.53 6.91,66.45 6.91,69.9 4.27,72.54 4.27,73.05 R1.1
N$2
  Top 0.152: 7.72,54.05 10.06,54.05 U2.6 | 7.72,54.05 5.49,54.05 4.27,52.83 R3.1 | 7.72,54.05 7.72,56.39 5.99,58.12 5.99,60.35 R4.2
N$3
  Top 0.152: 17.68,54.05 15.34,54.05 U2.9 | 17.68,54.05 19.91,54.05 21.13,52.83 R5.1 | 17.68,54.05 17.68,56.39 19.41,58.12 19.41,60.35 R6.2
N$4
  Top 0.152: U2.13 15.34,59.23 16.05,59.23 19.41,62.59 19.41,65.43 R8.2 19.51,65.53 22.15,68.17 22.15,69.9 21.23,70.81 21.23,73.05 R7.1
N$5
  Top 0.152: 7.06,12.55 5.99,11.48 R10.2 | 7.06,12.55 7.11,12.6 7.11,20.52 6.71,20.93 6.2,20.93 4.27,22.86 R9.1 | U4.2 9.45,10.16 7.06,12.55
N$6
  Top 0.152: 5.03,4.62 5.49,5.08 U4.6 | 5.03,4.62 4.27,3.86 R12.2 | 5.03,4.62 1.73,7.92 1.73,11.28 4.17,13.72 4.17,15.24 R11.1
N$7
  Top 0.152: R14.2 19.41,3.86 17.17,3.86 15.95,5.08 U4.9 16.05,5.08 16.76,5.79 16.76,6.1 17.78,7.11 17.78,8.94 18.19,9.35 19,9.35 20.32,10.67 20.32,12.6 21.13,13.41 21.13,15.24 R13.1
N$8  (via drill 0.35)
  Top 0.152: U4.13 15.95,10.16 17.17,11.38 19.41,11.38 R16.2 19.51,11.48 19.51,12.39 20.42,13.31 v20.42,14.02 | v21.13,20.42 21.13,22.86 R15.1
  Bottom 0.152: v21.13,20.42 21.13,14.73 v20.42,14.02
N$9
  Top 0.152: D3.A 46.13,90.22 46.13,93.17 46.94,93.98 U$1.9
N$10
  Top 0.152: 57.2,93.98 57.71,93.47 57.71,90.22 D5.C | 57.2,93.98 57.2,96.52 U$1.2 | 57.2,93.98 U$1.1
N$11
  Top 0.152: FB3.1 49.99,90.22 50.8,91.03 53.14,91.03 53.95,90.22 D5.A
N$12
  Top 0.152: FB1.1 38.71,90.22 42.27,90.22 D3.C
N$13
  Top 0.152: U$1.12 44.5,96.52 44.5,93.98 U$1.11
  Bottom 0.152: JP_5V.1-BUS 32.82,89.31 39.73,89.31 44.4,93.98 U$1.11
N$14
  Top 0.152: 25.91,91.95 27.64,91.95 28.55,92.86 IC1.3 | 25.91,91.95 24.18,91.95 C12.1 | 25.91,91.95 25.91,86.06 27.74,84.23 32.72,84.23 JP_5V.3-5V_VR
N$15
  Top 0.152: FB2.1 28.65,86.77 32.72,86.77 JP_5V.2-OUT
N$16  (via drill 0.35)
  Top 0.152: C16.1 28.55,79.05 28.55,74.07 C17.1 28.55,73.97 28.25,73.97 v26.11,71.83 | R17.2 16.87,48.26 v19.2,50.6 | v25.2,66.65 28.55,70 IC2.8
  Bottom 0.152: v19.2,50.6 19.2,60.66 v25.2,66.65 25.09,66.65 26.11,67.67 v26.11,71.83
N$17
  Top 0.152: R19.2 28.55,15.24 31.09,12.7 U5.3
N$18
  Top 0.152: R20.2 28.55,7.62 31.09,10.16 U5.5
N$19
  Top 0.152: 30.18,19.1 30.89,19.1 R22.1 | 30.18,19.1 27.53,19.1 R21.2 | 30.18,19.1 30.18,14.83 30.99,14.02 31.6,14.02 U5.2
N$20
  Top 0.152: 29.06,7.32 30.58,8.84 31.6,8.84 U5.6 | 29.06,7.32 25.91,4.17 25.91,3.86 R24.1 | 29.06,7.32 32.51,3.86 R23.2
N$21
  Top 0.152: R25.2 42.06,7.62 39.52,10.16 U5.10
N$22
  Top 0.152: R26.2 35.97,3.86 35.97,6.6 35.46,7.11 35.46,8.13 36.17,8.84 36.88,8.84 U5.9 36.98,8.84 40.23,8.84 45.21,3.86 R27.1
N$23  (via drill 0.35)
  Top 0.152: v51.1,20.22 54.97,24.08 R28.2 | v45.21,14.63 39.42,14.63 37.49,12.7 U5.12
  Bottom 0.152: v51.1,20.22 51.1,19.71 50.7,19.3 50.7,18.59 49.78,17.68 49.07,17.68 48.16,16.76 48.16,16.05 46.74,14.63 v45.21,14.63
N$24  (via drill 0.35)
  Top 0.152: R29.2 50.29,3.76 48.36,1.83 36.37,1.83 34.44,3.76 34.44,12.19 36.17,13.92 36.88,13.92 U5.13
  Top 0.254: U5.13 v34.92,13.97 | v37.59,17.78 37.59,18.96 R30.1
  Bottom 0.254: v34.92,13.97 34.92,15.11 v37.59,17.78
N$25
  Top 0.152: R31.2 27.53,34.24 28.55,34.24 30.99,31.8 31.6,31.8 U6.3
N$26
  Top 0.152: R33.1 30.18,38.1 | 30.18,38.1 R32.2 | U6.2 31.09,33.02 30.18,33.93 30.18,38.1
N$27
  Top 0.152: R34.2 27.53,26.72 28.55,26.72 30.99,29.16 31.6,29.16 U6.5
N$28
  Top 0.152: R36.1 30.18,22.86 | 30.18,22.86 R35.2 | U6.6 31.09,27.94 30.18,27.03 30.18,22.86
N$29
  Top 0.152: R37.2 41.05,26.72 40.03,26.72 37.59,29.16 36.98,29.16 U6.10
N$30
  Top 0.152: R38.2 38.41,22.86 | 38.41,22.86 R39.1 | U6.9 37.49,27.94 38.41,27.03 38.41,22.86
N$31
  Top 0.152: R40.2 41.05,34.24 40.03,34.24 37.59,31.8 36.98,31.8 U6.12
N$32
  Top 0.152: R41.2 38.41,38.1 | 38.41,38.1 R42.1 | U6.13 37.49,33.02 38.41,33.93 38.41,38.1
SCK
  Top 0.152: IC2.16 33.22,64.21 34.7,64.21 37.95,67.46 45.92,67.46 54.66,76.2 U$2.13
SDI
  Top 0.152: IC2.15 32.51,64.21 32.51,64.92 37.59,70 39.83,70 40.44,70.61 40.44,72.64 39.42,73.66 U$2.11
VBIAS  (via drill 0.35)
  Top 0.254: 11.58,7.11 10.87,6.4 10.16,6.4 U4.5 | 11.58,7.11 11.58,8.13 10.87,8.84 10.16,8.84 U4.3 10.06,8.94 v7.21,8.94 | 11.58,7.11 11.58,6.35 v11.99,6.35 | 14.02,6.91 13.82,7.11 13.82,8.13 14.53,8.84 15.24,8.84 U4.12 | 14.02,6.91 14.53,6.4 15.24,6.4 U4.10 | 14.02,6.91 v13.41,6.3 | 13.82,57.1 13.82,56.08 14.53,55.37 15.24,55.37 U2.10 | 13.82,57.1 14.53,57.81 15.24,57.81 U2.12 | 11.58,57.1 11.58,56.08 10.87,55.37 10.16,55.37 U2.5 | 11.58,57.1 10.87,57.81 10.16,57.81 U2.3 10.06,58.01 9.25,58.01 6.91,60.35 6.91,61.06 6.6,61.37 3.56,61.37 2.23,60.05 2.23,50.29 4.17,48.36 R17.1 4.27,48.26 4.27,44.5 R18.2 4.27,44.4 4.27,40.64 C18.1 4.17,40.54 2.23,38.61 2.23,21.54 3.05,20.73 3.05,18.59 v3.76,17.88 | v13.41,57.61 13.82,57.2 13.82,57.1 | v11.99,57.61 11.58,57.2 11.58,57.1
  Bottom 0.254: v13.41,6.3 13.36,6.35 v11.99,6.35 | v11.99,57.61 v13.41,57.61 | v7.21,8.94 6.5,8.94 4.98,10.46 4.98,16.66 v3.76,17.88
VOLT1
  Top 0.152: U2.1 10.06,60.45 10.06,62.99 7.32,65.73 7.32,71.73 5.99,73.05 R1.2 5.99,73.15 5.99,77.11 JP1.3 8.94,80.06 8.94,80.67 10.06,81.79 10.06,82.8 10.97,83.72 11.89,83.72 12.6,83.01 12.6,72.44 10.77,70.61 10.16,70.61 U1.3
VOLT2  (via drill 0.35)
  Top 0.152: R3.2 5.99,52.83 10.06,52.83 U2.7 10.16,52.83 10.77,52.83 v12.7,54.76 | JP1.7 13.41,79.45 13.41,69.8 11.68,68.07 10.16,68.07 U1.5
  Bottom 0.152: v12.7,54.76 12.7,55.88 14.12,57.3 14.12,79.86 JP1.7
VOLT3
  Top 0.152: R5.2 19.41,52.83 15.34,52.83 U2.8 15.24,52.83 14.63,52.83 13.82,53.65 13.82,54.66 12.7,55.78 12.7,60.96 16.76,65.02 16.76,67.26 16.05,67.97 15.34,67.97 U1.10 16.36,67.77 17.78,69.19 17.78,82.91 16.56,84.12 10.77,84.12 9.25,82.6 8.94,82.6 JP1.4
VOLT4  (via drill 0.35)
  Top 0.152: v19.41,75.49 19.41,73.15 R7.2 | v15.34,62.59 15.34,60.45 U2.14 | v17.07,70.61 15.34,70.61 U1.12
  Bottom 0.152: JP1.8 15.14,81.38 15.14,79.76 v19.41,75.49 19.3,75.49 15.34,71.53 15.34,70.61 | 15.34,70.61 v15.34,62.59 | 15.34,70.61 v17.07,70.61
VOLT5
  Top 0.152: 5.99,22.86 5.99,26.31 JP2.3 | 10.16,13.31 10.16,13.41 12.7,15.95 12.7,19.71 12.09,20.32 U3.3 | 10.16,13.31 10.16,11.48 U4.1 | 5.99,22.86 5.99,22.25 8.23,20.02 8.23,15.24 10.16,13.31 | 5.99,22.86 R9.2
VOLT6  (via drill 0.35)
  Top 0.152: U3.5 9.45,17.78 8.64,18.59 v8.64,25.4 | 3.5,16.1 1.32,13.92 1.32,5.18 3.66,2.85 9.14,2.85 10.06,3.76 U4.7 | 3.5,16.1 3.56,16.15 4.98,16.15 5.89,15.24 R11.2 | v2.23,19 2.23,17.37 3.5,16.1
  Bottom 0.152: JP2.7 12.8,28.04 11.68,28.04 9.04,25.4 v8.64,25.4 v2.23,19
VOLT7
  Top 0.152: R13.2 18.49,15.24 17.83,15.9 | 16.41,17.32 15.95,17.78 U3.10 | 16.41,17.32 17.83,15.9 | 17.83,15.9 12.7,10.77 12.7,5.79 14.63,3.86 15.24,3.86 U4.8 | 16.41,17.32 17.78,18.69 17.78,32.11 16.97,32.92 10.97,32.92 9.86,31.8 8.94,31.8 JP2.4
VOLT8  (via drill 0.35)
  Top 0.152: v20.93,30.38 20.93,27.84 19.51,26.42 19.51,22.86 R15.2 | v18.29,14.43 15.34,11.48 U4.14 | v17.07,20.32 U3.12
  Bottom 0.152: JP2.8 15.34,30.38 v20.93,30.38 22.05,31.5 22.66,31.5 23.06,31.09 23.06,29.97 18.29,25.2 18.29,20.32 | 18.29,20.32 v18.29,14.43 | 18.29,20.32 v17.07,20.32